# Altium schematic sheet Control Gates.SchDoc
size A
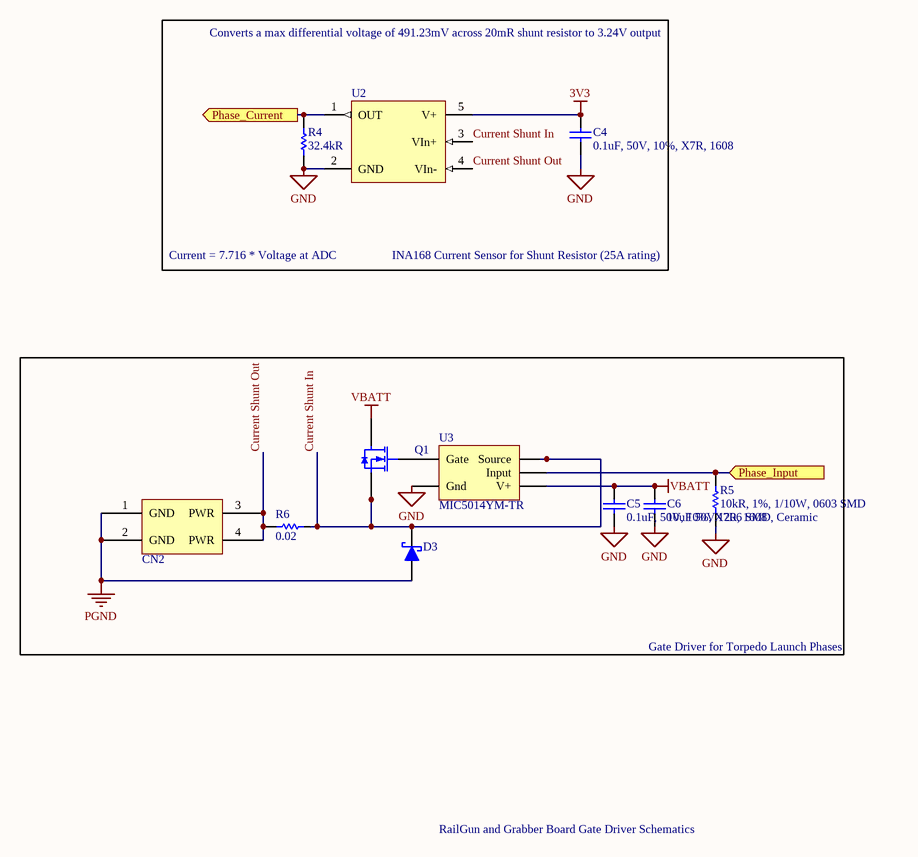
[diagram p0: Control Gates.SchDoc]

## Parts
C4  0.1uF, 50V, 10%, X7R, 1608  [CAPC1608N(0603")]
C5  0.1uF, 50V, 10%, X7R, 1608  [CAPC1608N(0603")]
C6  10uF 50V 1206 SMD, Ceramic  [CAPC3216N(1206")]
CN2  Header, Female, 2x2, RIght Angle, Pitch: 0.118"  (3.00mm), THT  [2x2 Pitch 118mil connector]  (value not drawn)
D3  TSSA5U50E3GCT-ND  [DO-214AC]  (value not drawn)
Q1  MOSFET N-Channel, 40V, 100A, 272W  [LFPAK-PowerSO8]  (value not drawn)
R4  Resistance: 32.4kR  [RESC1609X50X30ML10T20]  (hidden comment: 32.4kR, 1%, 0603, 1/10W)
R5  10kR, 1%, 1/10W, 0603 SMD  [RESC1608N(0603")]
R6  value 0.02  [RESC6332N(2512")]  (hidden comment: 0R02, 1%, 2W, 2512 SMD)
U2  INA168, Current Sensor, High-Side, Analog  [SOT23-5]  (value not drawn)
U3  MIC5014YM-TR  [SOC 8]

## Blocks framed on the sheet
Gate Driver for Torpedo Launch Phases: C5 C6 CN2 D3 Q1 R5 R6 U3

## Ports
Phase_Current (out), Phase_Input (in)

## Nets
3V3: C4.2(Cathode) U2.5(V+)
GND: C4.1(Anode) C5.2(Cathode) C6.2(Cathode) R4.1 R5.2 U2.2(GND) U3.4(Gnd)
PGND: CN2.1(GND) CN2.2(GND) D3.1(Anode)
VBATT: C5.1(Anode) C6.1(Anode) Q1.5(Drain) U3.1(V+)
Current Shunt In: D3.2(Cathode) Q1.1(Source) Q1.2(Source) Q1.3(Source) R6.2 U2.3(VIn+) U3.3(Source)
Current Shunt Out: CN2.3(PWR) CN2.4(PWR) R6.1 U2.4(VIn-)
Phase_Current: R4.2 U2.1(OUT) ; port Phase_Current
Phase_Input: R5.1 U3.2(Input) ; port Phase_Input
NetQ1_4: Q1.4(Gate) U3.5(Gate)

## Notes on the sheet
- Converts a max differential voltage of 491.23mV across 20mR shunt resistor to 3.24V output
- Current = 7.716 * Voltage at ADC
- INA168 Current Sensor for Shunt Resistor (25A rating)
- RailGun and Grabber Board Gate Driver Schematics
- Title
- Size:
- Date:
- A
- Number:
- Time:
- Revision:
- Sheet
- of
- File:

## Library data of the parts
C4 C5 = CMP-006-0008-1: CAP CER 0.1UF 50V 10% X7R 1608 (0603); Manufacturer: Samsung Electro-Mechanics America, Inc; Manufacturer Part Number: CL10B104KB8SFNC; Capacitance: 0.1µF; Size / Dimension: 0.063" L x 0.031" W (1.60mm x 0.80mm); Design Item ID: 0.1uF, 50V, 10%, X7R, 1608; RoHS: RoHS Compliant; Package / Case: 0603 (1608 Metric); Packaging: Cut Tape (CT); Height - Seated (Max): -; Component Type: Standard; Source: AUVic_Schematic_Library_Capacitors.SchLib; ComponentLink1URL: http://www.samsungsem.com/servlet/FileDownload?type=spec&file=CL10B104KB8SFNC.pdf; Tolerance: ±10%; Operating Temperature: -55°C ~ 125°C; Mounting Type: Surface Mount, MLCC; Features: Soft Termination; Lead Style: -; Pin Count: 2; Temperature Coefficient: X7R; Applications: Boardflex Sensitive; Voltage - Rated: 50V; Ratings: -; ComponentLink1Description: http://www.samsungsem.com/servlet/FileDownload?type=spec&file=CL10B104KB8SFNC.pdf; Thickness (Max): 0.035" (0.90mm); Stock 1: 743572; Category: Capacitors; Lead Spacing: -; Pricing 1: 1=0.12, 10=0.033, 25=0.0232, 100=0.0152, 500=0.01064, 1000=0.00829 (CAD)
C6 = CMP-006-0018-1: Capacitor, Ceramic, 50V, +/- 10%, 1206 SMD, X5R; Value: 10µF; Component Type: Standard; PackageDescription: Chip Capacitor; Design Item ID: 10uF 50V 1206 SMD, Ceramic; Published: 14-06-01; Publisher: AUVic; Source: AUVic_Schematic_Library_Capacitors.SchLib; Pin Count: 2
CN2 = CMP-005-0021-4: Connector Header Through Hole, Right Angle 4 position 0.118" (3.00mm); Created By: Poorna Chander Kalidas; Component Type: Standard; Source: AUVic_Schematic_Library_Connectors.SchLib; Publisher: AUVic; Design Item ID: Header, Female, 2x2, RIght Angle, Pitch: 0.118"  (3.00mm), THT; Date Published: 2020-05-16; Pin Count: 4
D3 = CMP-057-0021-1: Diode Schottky 50V 5A Surface Mount DO-214AC (SMA); Source: AUVic_Schematic_Library_Diodes.SchLib; Design Item ID: TSSA5U50E3GCT-ND; Date Created: 2018-06-01; Pin Count: 2; Component Type: Standard; Created By: Poorna Chander Kalidas
Q1 = CMP-052-0019-1: MOSFET N-Channel, 40V, 100A, 272W, Enh-Mode; MFG#: PSMN1R8-40YLC,115; MFG: NXP Semiconductors; Reviewed_By: Ashwin Sira; Latest_Revision_Note: Attached footprint; Publisher: AUVic; Design Item ID: MOSFET N-Channel, 40V, 100A, 272W; Created By: Ashwin Sira; Component Type: Standard; Latest_Revision_Date: 2016_04_26; Source: AUVic_Schematic_Library_Transistors.SchLib; Latest_Revision_By: Ashwin Sira; Reviewed_Date: 2016_04_26; Pin Count: 5
R4 = CMP-00121-1: VISHAY         CRCW060332K4FKEA.             SMD Chip Resistor, Thick Film, 32.4 kohm, 75 V, 0603 [1608 Metric], 100 mW,  1%, CRCW Series; Voltage Rating (DC): 75V; Power Rating: 100mW; Temperature Coefficient: 100ppm/°C; Height: 0.45mm; Min Operating Temperature: -55°C; Case Code (Imperial): 0603; Width: 0.85mm; Tolerance: 1%; Contact Plating: Tin; Max Operating Temperature: 155°C; Case/Package: 0603; Number of Terminations: 2; Termination: SMD/SMT; Max Power Dissipation: 100mW; Length: 1.55mm; REACH SVHC: Unknown; Packaging: Tape and Reel; Lead Free: Lead Free; Features: Automotive AEC-Q200; Voltage Rating: 75V; Military Standard: Not; Depth: 0.85mm; Number of Pins: 2; Mount: Surface Mount; Case Code (Metric): 1608; Weight: 7.1E-05oz; Resistor Type: Thick Film; Package Quantity: 10
R5 = CMP-047-0013-1: Owned By: AUVic; Made By: Ashwin Sira; Value: 10k; Design Item ID: 10kR, 1%, 1/10W, 0603 SMD; Pin Count: 2; Component Type: Standard; Created On: 14-05-31; Last Edited: 14-05-31; Source: AUVic_Schematic_Library_Resistors.SchLib
R6 = CMP-047-0006-1: Design Item ID: 0R02, 1%, 2W, 2512 SMD; Component Type: Standard; ComponentLink1URL: https://www.digikey.ca/product-detail/en/te-connectivity-passive-product/RLP73V3AR020FTDF/A109677CT-ND/4032443; Created By: Robert Keen; Source: AUVic_Schematic_Library_Resistors.SchLib; ComponentLink1Description: Digikey; Created On: 2018-08-16; Pin Count: 2
U2 = CMP-048-0001-2: Source: AUVic_Schematic_Library_Sensors.SchLib; Component Type: Standard; Pin Count: 5; Created By: Jacob Lower; Design Item ID: INA168, Current Sensor, High-Side, Analog; Created on: 2016-03-16; Publisher: AUVic
U3 = CMP-028-0000-2: High-Side or Low-Side Gate Driver IC Non-Inverting 8-SOIC; Number of Drivers: 1; Turn-On Delay Time: 8ms; Min Supply Voltage: 2.75V; Max Supply Voltage: 30V; Turn-Off Delay Time: 30us; Channel Type: Single; Max Output Current: 10mA; Lead Free: Lead Free; Max Operating Temperature: 85°C; Number of Pins: 8; Min Operating Temperature: -40°C; Height: 1.48mm; Mount: Surface Mount; Package Quantity: 2500; Case/Package: SOIC; Packaging: Tape and Reel; Number of Outputs: 1; Width: 3.94mm; Length: 4.93mm